# EAGLE design internal-v2 (EAGLE 7.7.0)

## Sheet 1 of 2
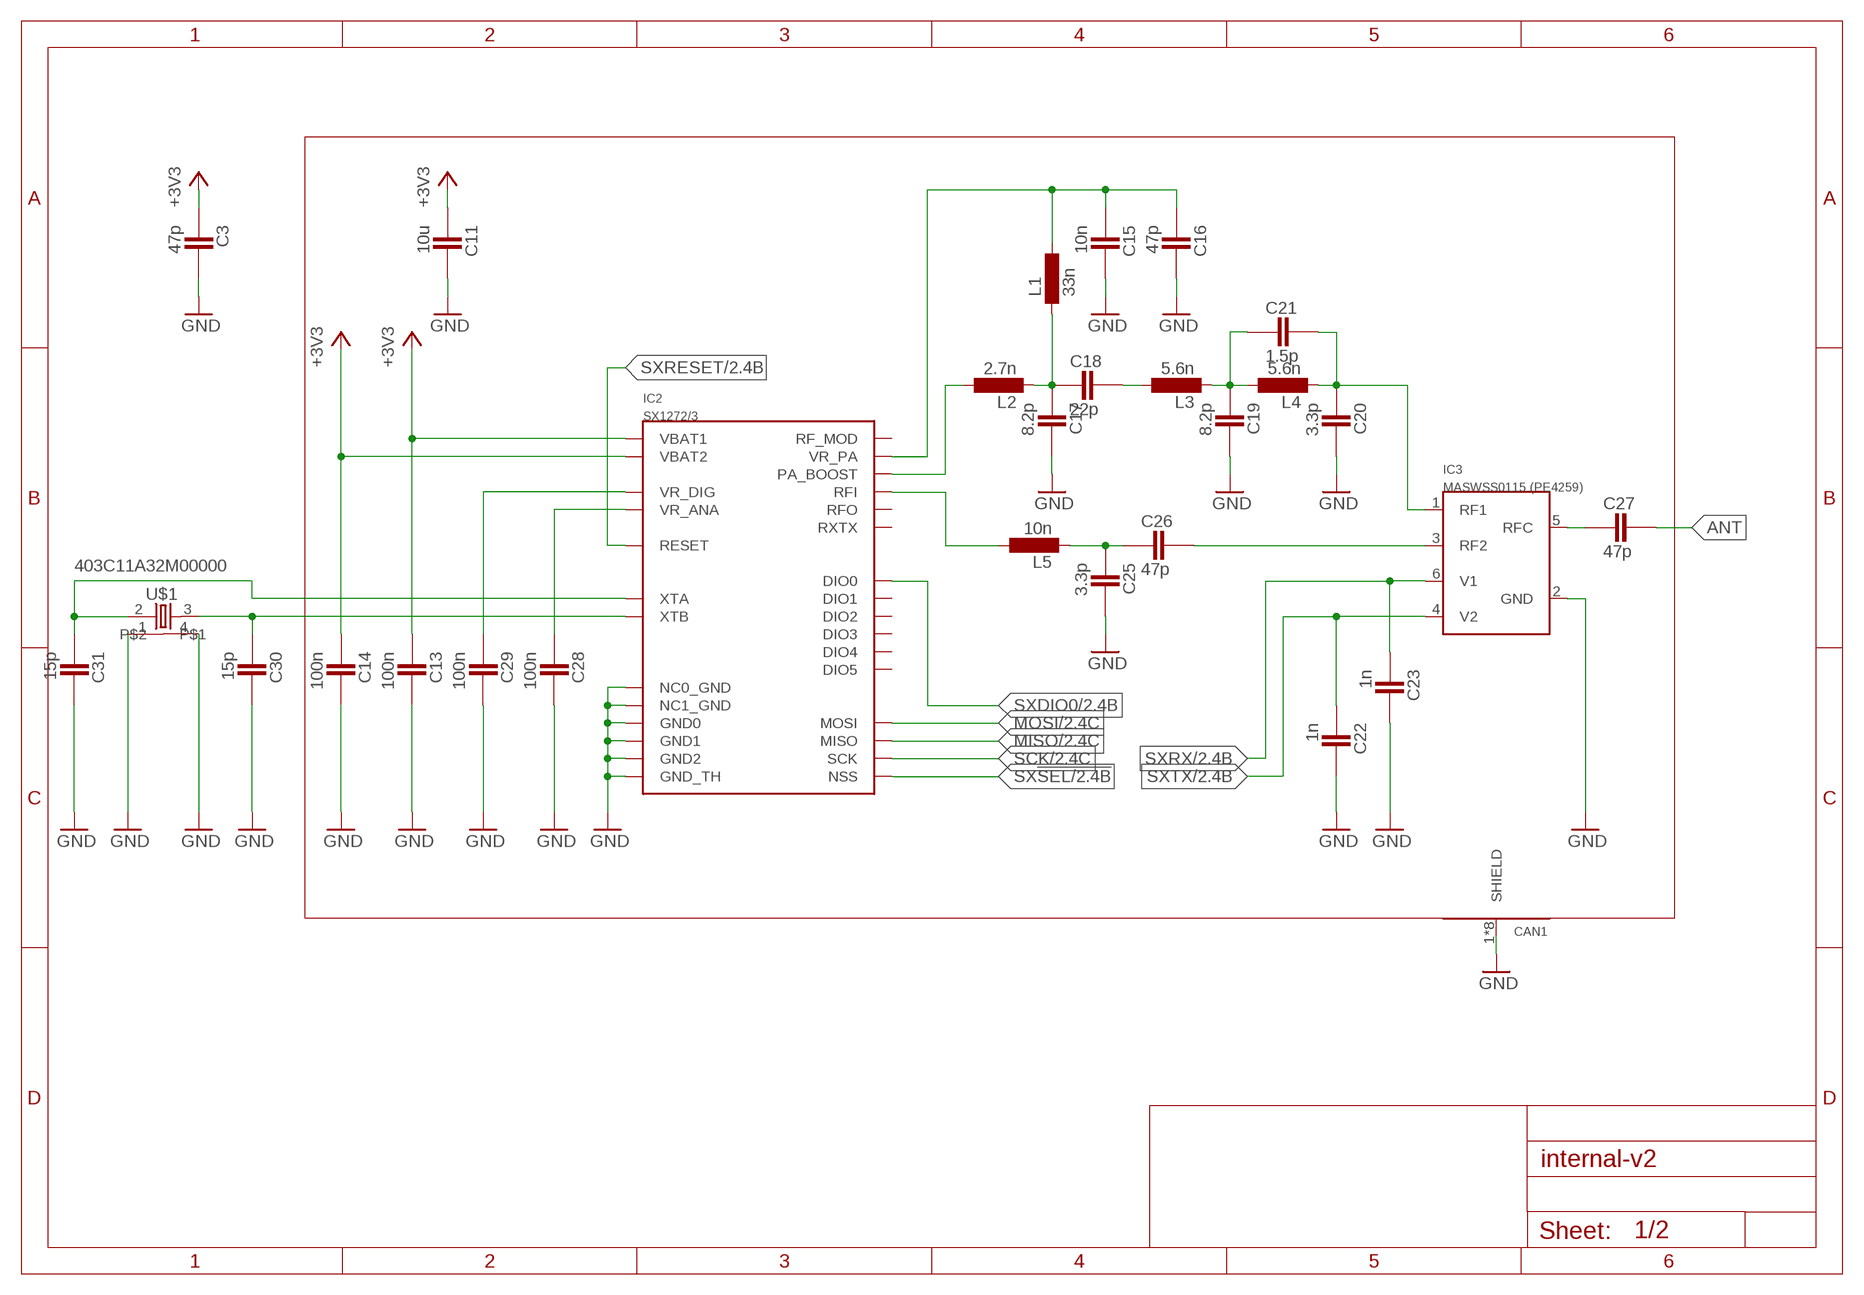
[diagram p0: schematic, sheet 1]

### Parts
C3  47p  CAPACITOR_0402  [CAPC1005X60N]
C11  10u  CAPACITOR_0805  [CAPC2012X145AN]
C13  100n  CAPACITOR_0402  [CAPC1005X60N]
C14  100n  CAPACITOR_0402  [CAPC1005X60N]
C15  10n  CAPACITOR_0402  [CAPC1005X60N]
C16  47p  CAPACITOR_0402  [CAPC1005X60N]
C17  8.2p  CAPACITOR_0402  [CAPC1005X60N]
C18  22p  CAPACITOR_0402  [CAPC1005X60N]
C19  8.2p  CAPACITOR_0402  [CAPC1005X60N]
C20  3.3p  CAPACITOR_0402  [CAPC1005X60N]
C21  1.5p  CAPACITOR_0402  [CAPC1005X60N]
C22  1n  CAPACITOR_0402  [CAPC1005X60N]
C23  1n  CAPACITOR_0402  [CAPC1005X60N]
C25  3.3p  CAPACITOR_0402  [CAPC1005X60N]
C26  47p  CAPACITOR_0402  [CAPC1005X60N]
C27  47p  CAPACITOR_0402  [CAPC1005X60N]
C28  100n  CAPACITOR_0402  [CAPC1005X60N]
C29  100n  CAPACITOR_0402  [CAPC1005X60N]
C30  15p  CAPACITOR_0402  [CAPC1005X60N]
C31  15p  CAPACITOR_0402  [CAPC1005X60N]
CAN1  RF-SHIELD  [RF-SHIELDING-13.66X12.70]
IC2  SX1272/3  [QFN28]
IC3  MASWSS0115 (PE4259)  MAXWSS0115  [SC-70]
L1  33n  INDUCTOR_0402  [INDC1005X60N]
L2  2.7n  INDUCTOR_0402  [INDC1005X60N]
L3  5.6n  INDUCTOR_0402  [INDC1005X60N]
L4  5.6n  INDUCTOR_0402  [INDC1005X60N]
L5  10n  INDUCTOR_0402  [INDC1005X60N]
U$1  403C11A32M00000  CRYSTAL  [MT]

### Nets
+3V3: C3.1 C11.1 C13.1 C14.1 IC2.P$1(VBAT1) IC2.P$15(VBAT2) ; also sheet 2
ANT [ant]: C27.2
GND: C3.2 C11.2 C13.2 C14.2 C15.2 C16.2 C17.2 C19.2 C20.2 C22.2 C23.2 C25.2 C28.2 C29.2 C30.2 C31.2 CAN1.1(SHIELD) CAN1.2(SHIELD) CAN1.3(SHIELD) CAN1.4(SHIELD) CAN1.5(SHIELD) CAN1.6(SHIELD) CAN1.7(SHIELD) CAN1.8(SHIELD) IC2.P$7(NC0_GND) IC2.P$8(NC1_GND) IC2.P$16(GND0) IC2.P$22(GND1) IC2.P$26(GND2) IC2.P$29(GND_TH) IC3.2(GND) U$1.1 U$1.4 ; also sheet 2
MISO: IC2.P$18(MISO) ; also sheet 2
MOSI: IC2.P$19(MOSI) ; also sheet 2
N$10: IC2.P$27(PA_BOOST) L2.2
N$11: C17.1 C18.1 L1.1 L2.1
N$12: C15.1 C16.1 IC2.P$28(VR_PA) L1.2
N$13: C18.2 L3.2
N$14: C19.1 C21.1 L3.1 L4.2
N$15: C27.1 IC3.5(RFC)
N$16: C20.1 C21.2 IC3.1(RF1) L4.1
N$17: IC2.P$25(RFI) L5.2
N$18: C25.1 C26.1 L5.1
N$19: C26.2 IC3.3(RF2)
N$21: C28.1 IC2.P$2(VR_ANA)
N$22: C29.1 IC2.P$3(VR_DIG)
N$23: C30.1 IC2.P$5(XTB) U$1.3
N$24: C31.1 IC2.P$4(XTA) U$1.2
SCK: IC2.P$17(SCK) ; also sheet 2
SX!SEL: IC2.P$20(NSS) ; also sheet 2
SXDIO0: IC2.P$9(DIO0) ; also sheet 2
SXRESET: IC2.P$6(RESET) ; also sheet 2
SXRX: C23.1 IC3.6(V1) ; also sheet 2
SXTX: C22.1 IC3.4(V2) ; also sheet 2
Unconnected: IC2.P$10(DIO1) IC2.P$11(DIO2) IC2.P$12(DIO3) IC2.P$13(DIO4) IC2.P$14(DIO5) IC2.P$21(RF_MOD) IC2.P$23(RXTX) IC2.P$24(RFO)

## Sheet 2 of 2
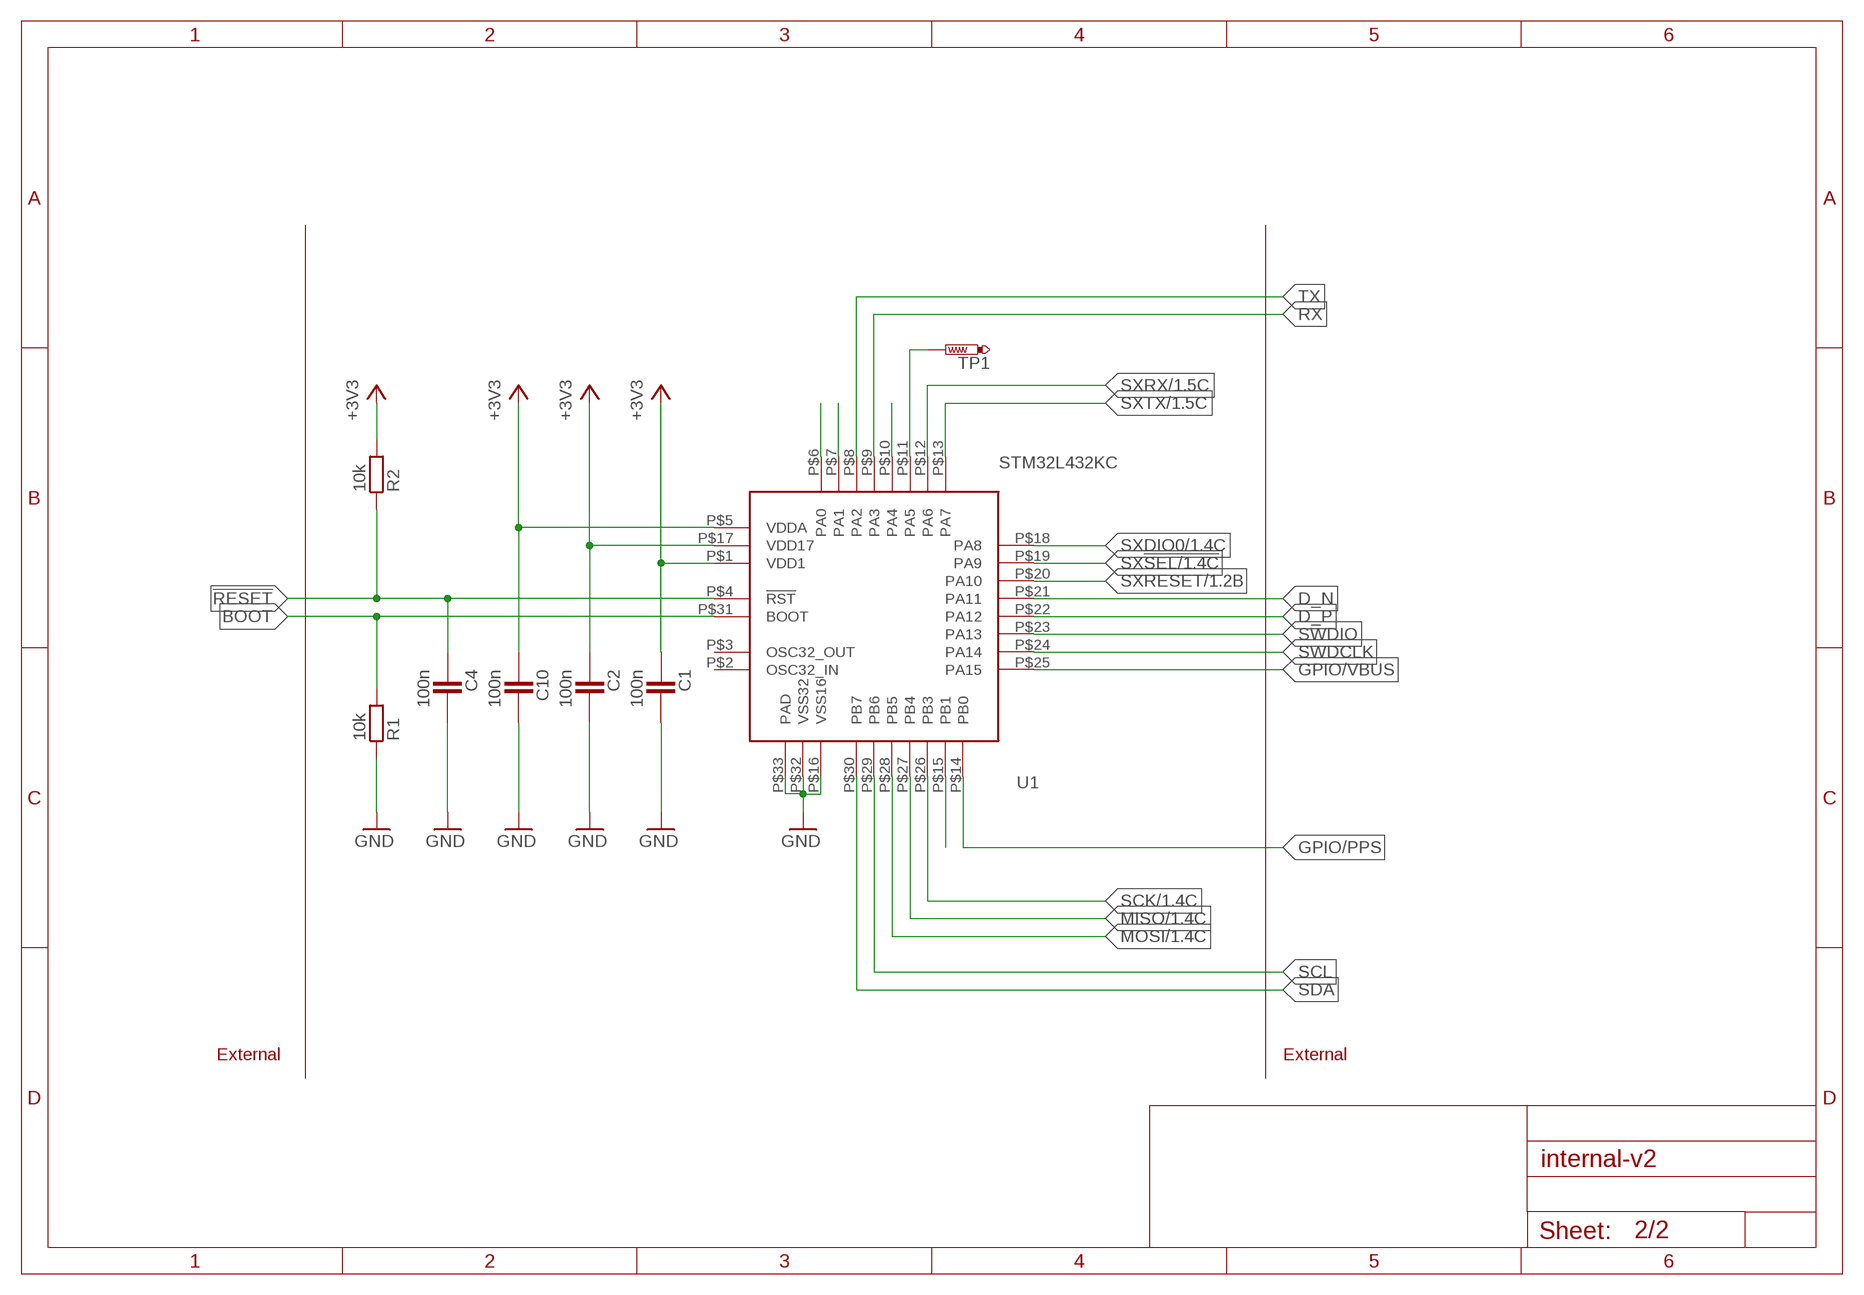
[diagram p1: schematic, sheet 2]

### Parts
C1  100n  CAPACITOR_0402  [CAPC1005X60N]
C2  100n  CAPACITOR_0402  [CAPC1005X60N]
C4  100n  CAPACITOR_0402  [CAPC1005X60N]
C10  100n  CAPACITOR_0402  [CAPC1005X60N]
R1  10k  RESISTOR_0402  [RESC1005X40AN]
R2  10k  RESISTOR_0402  [RESC1005X40AN]
TP1  PTR1TP06R  [TP06R]
U1  STM32L432KC  [STM32L432KC]

### Nets
!RESET: C4.1 R2.1 U1.P$4(!RST)
+3V3: C1.1 C2.1 C10.1 R2.2 U1.P$1(VDD1) U1.P$5(VDDA) U1.P$17(VDD17) ; also sheet 1
A0: U1.P$10(PA4)
A1: TP1.TP U1.P$11(PA5)
A2: U1.P$6(PA0)
A4: U1.P$15(PB1)
BOOT: R1.2 U1.P$31(BOOT)
D13: U1.P$7(PA1)
D_N: U1.P$21(PA11)
D_P: U1.P$22(PA12)
GND: C1.2 C2.2 C4.2 C10.2 R1.1 U1.P$16(VSS16) U1.P$32(VSS32) U1.P$33(PAD) ; also sheet 1
GPIO/PPS: U1.P$14(PB0)
GPIO/VBUS: U1.P$25(PA15)
MISO: U1.P$27(PB4) ; also sheet 1
MOSI: U1.P$28(PB5) ; also sheet 1
RX: U1.P$9(PA3)
SCK: U1.P$26(PB3) ; also sheet 1
SCL: U1.P$29(PB6)
SDA: U1.P$30(PB7)
SWDCLK: U1.P$24(PA14)
SWDIO: U1.P$23(PA13)
SX!SEL: U1.P$19(PA9) ; also sheet 1
SXDIO0: U1.P$18(PA8) ; also sheet 1
SXRESET: U1.P$20(PA10) ; also sheet 1
SXRX: U1.P$12(PA6) ; also sheet 1
SXTX: U1.P$13(PA7) ; also sheet 1
TX: U1.P$8(PA2)
Unconnected: U1.P$2(OSC32_IN) U1.P$3(OSC32_OUT)

### Notes on the sheet
- External | External

## Library data of the parts
C1-C4 C10 C11 C13-C23 C25-C31 = ipc-7351-capacitor:CAPACITOR_
CAN1 = sid:RF-SHIELD
IC2 = sid:SX1272/3
IC3 = sid:MAXWSS0115
L1-L5 = ipc-7351-inductor:INDUCTOR_
R1 R2 = ipc-7351-resistor:RESISTOR_
TP1 = testpad:PTR1: TEST PIN
U1 = STM32L432KC:STM32L432KC: STM32L432KC UFQFPN32 - 32-pin, 5x5 mm, 0.5 mm pitch ultra thin fine pitch quad flat package http://www.st.com/content/ccc/resource/technical/document/datasheet/24/01/9f/59/f0/83/47/fc/DM00257205.pdf/files/DM00257205.pdf/jcr:content/translations/en.DM00257205.pdf
U$1 = Labor-old:CRYSTAL: SMD Crystal FEATURES Frequency range 12MHz to 60MHz, fundamental mode Ultra-small package 3.2mm x 2.5mm x 0.6mm Packaged in standard EIA tape and reel Ideal for PDAs, hand-held GPS, PCMCIA etc. MT crystals are ultra-miniature AT-cut crystals covering the frequency range 12MHz to 60MHz in fundamental mode and up to 150MHz in 3rd overtone mode. Their small size and low mass makes these crystals ideal for miniaturized hand-held equipment and similar high-density applications.

## Net classes
1 ant: clearance 0.381 mm

## Board
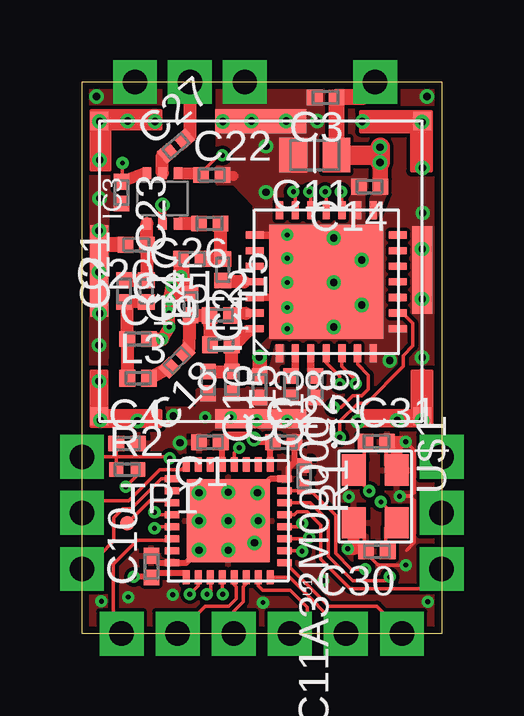
[diagram p2: board, top side]
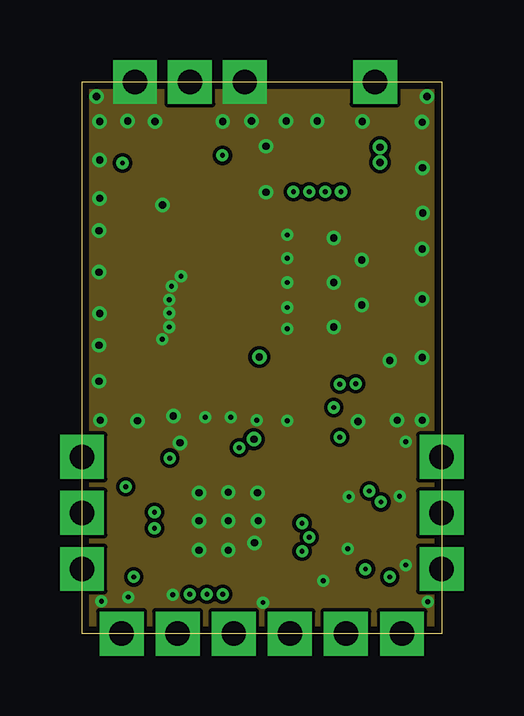
[diagram p3: board, inner layer Route2]
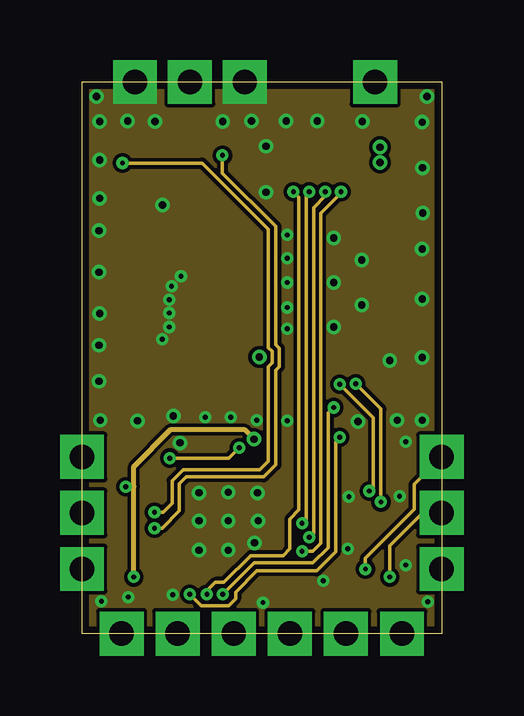
[diagram p4: board, inner layer Route15]
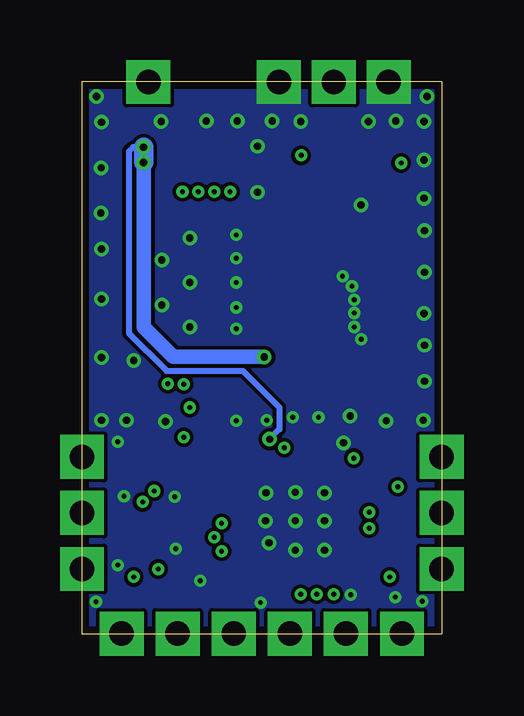
[diagram p5: board, bottom side, seen from below]

Size 14.99 x 22.99 mm. Coordinates in mm from the lower left corner, seen from the top.
Outline: 0,22.99 14.99,22.99 14.99,0 0,0 0,22.99
Copper layers (1+2*15+16): Top 0.035mm / dielectric 0.3mm / Route2 0.035mm / dielectric 0.36mm / Route15 0.035mm / dielectric 0.3mm / Bottom 0.035mm
Design rules "PCB-POOL Standard_ML4 *": minimum track width 0.15mm, minimum drill 0.2mm, track to track 0.15mm, track to pad 0.15mm, pad to pad 0.15mm, via to via 0.15mm, smd to smd 0.15mm, copper to edge 0.3mm, drill to drill 0.2mm, minimum pad ring 0.2mm, minimum via ring 0.15mm, stop-mask expansion 0.075mm, vias tented up to drill 16mil, thermal gap 0.2mm

### Footprints (pad centres in the part's own frame; a part is rotated, then mirrored left to right if it is on the bottom)
CAPC1005X60N = smd 0.65 x 0.65: 1 -0.45,0; 2 0.45,0
CAPC2012X145AN = smd 1.15 x 1.45: 1 -0.9,0; 2 0.9,0
RF-SHIELDING-13.66X12.70 = smd 0.762 x 0.762: 1 0.703,13.96; 3 13,13.96; 5 13,0.5; 7 0.703,0.5 | smd 3.8 x 0.762: 2 6.75,13.959 | smd 1 x 3.8: 4 13,7.23 | smd 3.648 x 0.838: 6 6.801,0.5 | smd 0.797 x 3.8: 8 0.602,7.23
QFN28 = smd 0.75 x 0.3: P$1 -2.975,1.95; P$2 -2.975,1.3; P$3 -2.975,0.65; P$4 -2.975,0; P$5 -2.975,-0.65; P$6 -2.975,-1.3; P$7 -2.975,-1.95; P$15 2.975,-1.95; P$16 2.975,-1.3; P$17 2.975,-0.65; P$18 2.975,0; P$19 2.975,0.65; P$20 2.975,1.3; P$21 2.975,1.95 | smd 0.3 x 0.75: P$8 -1.95,-2.975; P$9 -1.3,-2.975; P$10 -0.65,-2.975; P$11 0,-2.975; P$12 0.65,-2.975; P$13 1.3,-2.975; P$14 1.95,-2.975; P$22 1.95,2.975; P$23 1.3,2.975; P$24 0.65,2.975; P$25 0,2.975; P$26 -0.65,2.975; P$27 -1.3,2.975; P$28 -1.95,2.975 | smd 4.75 x 4.75: P$29 0,0
SC-70 = smd 0.35 x 0.5: 1 -0.65,-1.05; 2 0,-1.05; 3 0.65,-1.05; 4 0.65,1.05; 5 0,1.05; 6 -0.65,1.05
INDC1005X60N = smd 0.65 x 0.7: 1 -0.45,0; 2 0.45,0
RESC1005X40AN = smd 0.6 x 0.6: 1 -0.45,0; 2 0.45,0
TP06R = smd 0.6 x 0.6: TP 0,0
STM32L432KC = smd 0.6 x 0.3: P$1 -2.35,1.75; P$2 -2.35,1.25; P$3 -2.35,0.75; P$4 -2.35,0.25; P$5 -2.35,-0.25; P$6 -2.35,-0.75; P$7 -2.35,-1.25; P$8 -2.35,-1.75; P$17 2.35,-1.75; P$18 2.35,-1.25; P$19 2.35,-0.75; P$20 2.35,-0.25; P$21 2.35,0.25; P$22 2.35,0.75; P$23 2.35,1.25; P$24 2.35,1.75 | smd 0.3 x 0.6: P$9 -1.75,-2.35; P$10 -1.25,-2.35; P$11 -0.75,-2.35; P$12 -0.25,-2.35; P$13 0.25,-2.35; P$14 0.75,-2.35; P$15 1.25,-2.35; P$16 1.75,-2.35; P$25 1.75,2.35; P$26 1.25,2.35; P$27 0.75,2.35; P$28 0.25,2.35; P$29 -0.25,2.35; P$30 -0.75,2.35; P$31 -1.25,2.35; P$32 -1.75,2.35 | smd 3.45 x 3.45: P$33 0,0
MT = smd 1.3 x 1: 1 1.1,-0.9; 2 -1.1,-0.9; 3 1.1,0.9; 4 -1.1,0.9

### Placement (x,y rotation side)
C1  5.33,7.98 180 top
C2  8.41,7.98 0 top
C3  10.15,22.34 180 top
C4  1.88,7.92 0 top
C10  2.9,2.79 90 top
C11  9.7,19.94 180 top
C13  7.4,10.29 270 top
C14  11.99,18.62 180 top
C15  6.25,10.46 270 top
C16  5.26,10.46 270 top
C17  4.52,13.72 90 top
C18  3.96,11.39 225 top
C19  2.34,12.27 0 top
C20  2.26,16.21 180 top
C21  1.75,14.27 90 top
C22  5.41,19.11 0 top
C23  1.65,18.38 270 top
C25  4.58,15.62 180 top
C26  5.32,17.09 180 top
C27  3.91,20.32 40 top
C28  8.71,10.29 270 top
C29  9.73,10.29 270 top
C30  12.29,3.43 180 top
C31  12.27,8 0 top
CAN1  14.68,8.36 90 top
IC2  10.19,14.66 90 top
IC3  3.35,18.14 0 top
L1  5.79,12.04 0 top
L2  5.77,13.26 0 top
L3  2.34,10.64 0 top
L4  2.68,14.27 270 top
L5  5.87,15.16 270 top
R1  9.27,6.55 270 top
R2  1.88,6.83 0 top
TP1  1.88,4.6 0 top
U1  6.1,4.7 270 top
U$1  12.22,5.72 270 top

### Tracks (layer width: path | path; a pad name or v marks a point on that pad's centre or on a via)
!RESET  (via drill 0.2, 1.02)
  Top 0.152: U1.P$4 6.35,7.54 v6.55,7.75 | R2.1 1.43,7.37 | 1.43,7.37 3.61,7.37 v3.66,7.32 | 1.43,7.37 C4.1 | 1.43,7.37 v0,7.37
  Route15 0.152: v3.66,7.32 6.12,7.32 v6.55,7.75
+3V3  (via drill 0.2, 0.3, 1.02)
  Top 0.152: R2.2 2.33,6.62 v1.83,6.12 | 10.6,22.35 C3.1
  Top 0.254: v12.22,22.99 12.22,22.89 | U1.P$17 4.35,2.51 3.07,2.51 2.91,2.36 | 2.91,2.36 C10.1 | U1.P$1 7.85,7.98 C2.1 7.16,7.98 v7.16,8.1 7.16,8.28 6.09,8.28 C1.1 5.85,7.91 U1.P$5 | 2.91,2.36 v2.16,2.36
  Top 0.61: v7.39,11.53 v7.4,11.53 C13.1
  Top 0.635: v12.42,19.63 12.42,18.91 C14.1
  Top 0.66: 12.22,22.89 11.68,22.35 10.6,22.35 C11.1
  Top 0.813: C11.1 12.42,19.94 v12.42,19.63 v12.42,20.27
  Route15 0.152: 2.16,6.12 v1.83,6.12
  Route15 0.203: v2.16,2.36 2.16,6.12 2.16,6.96 3.71,8.51 6.76,8.51 v7.16,8.1
  Bottom 0.254: v12.42,20.27 12.85,20.27 13.03,20.09 13.03,12.52 11.46,10.95 8.28,10.95 6.76,9.42 6.76,8.51 v7.16,8.1
  Bottom 0.61: v12.42,19.63 12.42,12.78 11.18,11.53 v7.39,11.53
  Bottom 0.813: v12.42,20.27 v12.42,19.63
  pour Top (no thermals): 7.16,10.49 8.2,10.49 8.38,11.3 8.38,11.99 8.1,11.99 7.85,11 7.16,11
  pour Top (no thermals): 12.04,17.3 12.04,18.06 12.17,18.44 12.17,19.41 12.65,19.41 12.65,18.36 12.24,17.3
A1
  Top 0.152: U1.P$11 3.66,5.54 2.82,5.54 TP1.TP
ANT  (via drill 1.02)
  Top 0.152: 4.5,22.81 v4.5,22.99
  Top 0.254: 4.5,20.75 4.35,20.61 C27.2
  Top 0.533: C27.2 4.5,20.75
  Top 0.549: 4.5,22.81 4.5,20.75
BOOT  (via drill 0.2, 1.02)
  Top 0.15: U1.P$31 9.12,5.95 R1.2 9.35,5.89 9.6,5.89 10.57,4.93 10.57,3.35 11.23,2.69 v11.81,2.69
  Route15 0.15: v11.81,2.69 11.81,3.15 13.84,5.18 13.84,6.22 v14.99,7.37
D_N  (via drill 1.02)
  Top 0.15: U1.P$21 6.35,2.04 6.43,1.96 6.43,1.46 6.12,1.15 5.14,1.15 v3.99,0
D_P  (via drill 1.02)
  Top 0.15: U1.P$22 6.85,2.07 6.73,1.96 6.73,1.33 6.32,0.93 v6.32,0
GND  (via drill 0.2, 0.3, 1.02)
  Top 0.152: U$1.1 11.57,4.62 11.77,4.42 11.77,3.47 11.81,3.43 C30.2 | U$1.4 12.87,6.82 12.67,7.02 12.67,7.98 12.7,8 C31.2 | 13.54,3.48 13.84,3.81 13.84,5.56 13.69,5.72 v13.23,5.72 | v11.07,3.56 11.63,3.56 12.34,2.84 13.51,2.84 | 13.23,5.74 13.72,5.74 13.84,5.87 13.84,7.65 13.49,8
  Top 0.254: 8.86,7.16 8.61,6.91 8.61,6.45 U1.P$32 7.85,6.45 U1.P$33 4.35,2.95 U1.P$16 3.19,2.95 C10.2 | 8.86,7.16 C2.2 | R1.1 9.04,7.16 8.86,7.16
  Top 0.305: 14.25,9.14 14.25,8.89 | 14.17,9.83 14.17,10.92
  Top 0.318: IC2.P$26 9.11,14.01 9.22,13.89 | IC2.P$22 7.98,16.61 v8.56,16.61 | C25.2 | C17.2 4.5,14.34 4.37,14.25
  Top 0.356: IC3.2 v3.35,17.86
  Top 0.406: 6.31,19.06 C22.2 | 0.79,16.21 v0.71,16.79
  Top 0.508: v3.35,12.27 v3.63,12.78 v3.63,13.92 v3.73,14.48 v4.13,14.89 | 13.49,7.98 13.11,7.98 13.11,6.73 | 11.13,3.53 11.33,3.53 11.33,4.62
  Top 0.559: v4.13,14.89 C17.2 | C19.2 v3.35,12.27
  Top 0.635: C20.2 0.79,16.21
  Top 0.66: C25.2 v4.13,14.89
  Top 0.813: 3.86,14.25 4.37,14.25
  other vias: 0.71,15.06 0.74,13.33 0.71,12.01 0.71,10.52 5.87,21.34 10.49,14.63 3.05,21.34 1.9,21.36 0.74,19.74 0.74,18.14 0.76,8.89 0.74,21.34 14.17,21.31 14.17,8.89 8.56,15.65 8.56,14.63 14.17,11.51 14.17,13.94 6.2,9.02 5.13,9.02 7.29,8.89 7.67,18.39 9.8,21.36 11.68,21.34 14.2,17.53 2.31,8.86 3.81,9.07 8.56,8.86 11.51,8.84 13.13,8.89 14.17,16.03 14.19,19.41 8.51,21.36 7.67,20.31 2.21,22.99 6.78,22.99 11.13,5.7 0.61,22.38 7.06,21.36 3.63,13.36 13.49,2.86 14.38,22.38 8.56,13.59 8.56,12.7 4.09,7.95 12.83,11.38 1.93,1.52 3.78,1.63 7.54,1.3 10.06,2.21 14.4,1.32 0.81,1.35 13.49,7.99 10.49,16.48 10.49,12.78 11.66,13.69 11.66,15.57 6.1,4.7 6.1,5.89 4.88,4.7 7.34,4.7 7.32,5.87 4.88,5.87 6.1,3.48 4.88,3.48 7.19,3.78
  pour Top (rank 3, no thermals): 4.8,10.13 4.8,8.43 9.3,8.43 9.3,9.3 8.79,9.53 8.79,10.39 7.06,10.39 6.76,10.13
  pour Route2 (no thermals): 0.08,0.03 14.91,0.03 14.91,22.91 0.08,22.91
  pour Top (rank 5, no thermals): 6.93,10.16 4.83,10.16 4.83,9.4 1.04,9.4 1.07,17.68 1.47,17.68 1.47,18.85 2.03,18.85 2.03,21.23 3.28,21.23 3.28,22.91 0.08,22.91 0.08,8.41 14.91,8.41 14.91,22.91 5.64,22.91 5.64,18.75 6.32,18.75 7.19,17.86 7.19,16.51 7.95,16.51 7.95,12.45 7.19,11.68 7.19,10.41
  pour Bottom (no thermals): 0.08,0.03 14.91,0.03 14.91,22.91 0.08,22.91
  pour Route15 (no thermals): 0.08,0.03 14.91,0.03 14.91,22.91 0.08,22.91
  pour Top: 0.08,9.02 0.08,0.03 14.91,0.03 14.91,9.02
GPIO/PPS  (via drill 1.02)
  Top 0.15: U1.P$14 3.73,3.94 3.69,3.9 2.3,3.9 1.3,2.9 1.3,0.36 v1.65,0
GPIO/VBUS  (via drill 1.02)
  Top 0.15: U1.P$25 8.48,2.95 10.29,1.14 12.29,1.14 13.33,0.1 v13.33,0
MISO  (via drill 0.2)
  Top 0.15: U1.P$27 8.46,3.96
  Top 0.152: 8.46,3.96 9.42,3.96 v9.47,4.01 | v10.13,18.42 10.19,18.36 IC2.P$18
  Route15 0.152: v9.47,4.01 9.65,4.19 9.65,17.75 10.13,18.24 v10.13,18.42
MOSI  (via drill 0.2)
  Top 0.15: IC2.P$19 9.52,17.64
  Top 0.152: U1.P$28 9.02,4.45 v9.17,4.6 | 9.52,17.64 9.52,18.36 v9.47,18.42
  Route15 0.152: v9.17,4.6 9.35,4.78 9.35,18.24 v9.47,18.42
N$10
  Top 0.318: IC2.P$27 6.8,13.36 6.85,13.35 | 6.17,13.33 L2.2
  Top 0.533: 6.85,13.35 6.17,13.33
N$11
  Top 0.318: C18.1 4.47,11.91 | L1.1 5.34,12.32 | 4.52,13.34 C17.1
  Top 0.533: C17.1 L2.1 5.34,12.32 | 4.47,11.91 C17.1
N$12
  Top 0.318: IC2.P$28 6.9,12.59 | 6.34,12.01 L1.2 6.24,12.07
  Top 0.549: 6.9,12.59 6.34,12.01 | 6.24,12.07 6.24,11.22 6.25,11.22 C15.1 C16.1
N$13
  Top 0.549: L3.2 C18.2
N$14
  Top 0.318: C19.1 | 1.88,13.7 C21.1
  Top 0.549: L4.2 C21.1 | C19.1 L3.1 | C19.1 1.88,13.7
N$15
  Top 0.368: 3.35,19.93 C27.1
  Top 0.549: IC3.5 3.35,19.93
N$16
  Top 0.318: C20.1 2.7,16.06 | 2.7,14.72 L4.1
  Top 0.549: IC3.1 2.7,16.06 2.7,14.72 | C21.2 L4.1
N$17
  Top 0.318: IC2.P$25 6.74,14.66 | 5.89,14.66 L5.2
  Top 0.549: 6.74,14.66 5.89,14.66
N$18
  Top 0.318: L5.1 5.88,15.8 5.8,15.62
  Top 0.549: C25.1 5.8,15.62 5.79,15.65 5.79,17.07 C26.1
N$19
  Top 0.318: 4.1,17.09 IC3.3
  Top 0.549: C26.2 4.1,17.09
N$21
  Top 0.254: 8.89,10.83 8.89,10.74 C28.1
  Top 0.305: IC2.P$2 8.89,10.83
N$22
  Top 0.254: 9.54,10.96 9.54,10.74 C29.1
  Top 0.305: IC2.P$3 9.54,10.96
N$23  (via drill 0.2)
  Top 0.152: v12.46,5.49 13.12,4.83 U$1.3 12.87,4.62 12.67,4.42 12.67,3.46 12.7,3.43 C30.1 | IC2.P$5 10.84,11.14 11.4,10.57 v11.4,10.41
  Route15 0.152: v12.46,5.49 12.46,9.36 v11.4,10.41
N$24  (via drill 0.2)
  Top 0.152: IC2.P$4 10.19,11.28 10.74,10.72 v10.74,10.39 | v11.98,5.94 11.32,6.6 U$1.2 11.77,7.27 11.76,7.95 C31.1
  Route15 0.152: v11.98,5.94 12.14,6.11 12.14,8.99 v10.74,10.39
RX  (via drill 1.02)
  Top 0.152: U1.P$9 3.3,6.45 2.06,5.21 1.7,5.21 1.32,4.83 1.32,3.86 0.18,2.69 v0,2.69
SCK  (via drill 0.2)
  Top 0.15: 9.16,3.45 v9.17,3.43
  Top 0.152: U1.P$26 9.16,3.45 | IC2.P$17 10.84,18.37 v10.79,18.42
  Route15 0.15: 10.79,18.36 v10.79,18.42
  Route15 0.152: v9.17,3.43 9.63,3.43 9.96,3.76 9.96,17.53 10.79,18.36
SCL  (via drill 1.02)
  Top 0.15: U1.P$29 8.84,4.95 8.97,5.08 9.4,5.08 9.96,4.52 9.96,3.1 11.18,1.88 14.6,1.88 14.99,2.26 v14.99,2.69
SDA  (via drill 0.2, 1.02)
  Top 0.15: U1.P$30 9.51,5.45 10.26,4.7 10.26,3.23 11.28,2.21 12.7,2.21 v12.83,2.36
  Route15 0.15: v12.83,2.36 12.83,3.66 14.2,5.03 v14.99,5.03
SWDCLK  (via drill 1.02)
  Top 0.15: U1.P$24 8.65,2.35 v11,0
SWDIO  (via drill 1.02)
  Top 0.15: U1.P$23 7.35,2 7.54,1.8 8.69,1.8 9.4,1.09 9.4,0.69 8.71,0 v8.66,0
SX!SEL  (via drill 0.2)
  Top 0.152: IC2.P$20 8.89,18.34 v8.81,18.42 | U1.P$19 5.36,2.34 5.36,1.79 v5.21,1.64
  Route15 0.152: v8.81,18.42 9.04,18.19 9.04,5.16 8.66,4.78 8.66,3.53 8.38,3.25 7.04,3.25 5.92,2.13 5.56,2.13 5.21,1.78 v5.21,1.64
SXDIO0  (via drill 0.2)
  Top 0.152: IC2.P$9 13.36,13.36 13.79,12.93 13.79,11.99 13.39,11.58 13.39,11.15 11.86,9.6 11.51,9.6 10.74,8.84 v10.74,8.18 | U1.P$18 4.85,1.99 v4.5,1.64
  Route15 0.152: v10.74,8.18 10.57,8 10.57,3.4 9.78,2.62 7.29,2.62 6.4,1.73 6.4,1.45 6.11,1.16 4.98,1.16 v4.5,1.64
SXRESET  (via drill 0.2)
  Top 0.152: IC2.P$6 11.49,11.22 11.94,10.77 11.94,10.19 11.66,9.91 11.28,9.91 10.79,9.42 v10.49,9.42 | U1.P$20 5.85,1.67 v5.87,1.64
  Route15 0.152: v10.49,9.42 10.26,9.19 10.26,3.58 9.63,2.95 7.18,2.95 v5.87,1.64
SXRX  (via drill 0.2)
  Top 0.152: v1.69,19.61 1.69,18.79 C23.1 | U1.P$12 3.12,4.95 v3.02,5.05
  Top 0.305: IC3.6 2.64,19.19 2.62,19.18
  Top 0.508: 2.62,19.18 1.74,18.85 C23.1
  Route15 0.152: v1.69,19.61 5,19.61 7.77,16.84 7.77,11.91 7.92,11.76 7.92,11.28 7.77,11.13 7.77,7.19 7.42,6.83 4.22,6.83 3.76,6.38 3.76,5.44 3.38,5.05 v3.02,5.05
SXTX  (via drill 0.2)
  Top 0.152: 4.76,19.18 4.94,19.18 5.7,19.94 v5.85,19.93 | U1.P$13 3.08,4.45 v3.02,4.39
  Top 0.305: IC3.4 4.08,19.19 4.09,19.18
  Top 0.508: 4.09,19.18 4.76,19.18 C22.1
  Route15 0.152: v5.85,19.93 5.85,19.19 8.08,16.97 8.08,12.04 8.23,11.89 8.23,11.13 8.08,10.97 8.08,7.04 7.57,6.53 4.34,6.53 4.06,6.25 4.06,5.12 3.34,4.39 v3.02,4.39
TX  (via drill 1.02)
  Top 0.152: U1.P$8 4.13,6.83 3.25,6.83 1.96,5.54 0.51,5.54 v0,5.03